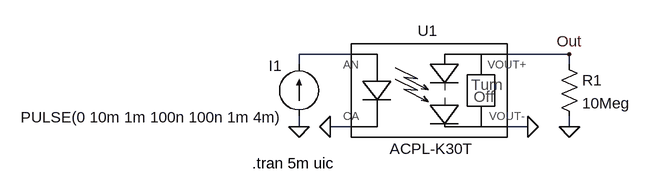
[diagram p0: schematic ACPL-K30T_TRAN.asc]
ACPL-K30T_TRAN.asc, the LTspice schematic file:
Version 4
SHEET 1 896 680
WIRE 160 32 80 32
WIRE 496 32 400 32
WIRE 80 48 80 32
WIRE 496 48 496 32
WIRE 80 144 80 128
WIRE 160 144 128 144
WIRE 432 144 400 144
WIRE 496 144 496 128
FLAG 128 144 0
FLAG 80 144 0
FLAG 432 144 0
FLAG 496 144 0
FLAG 496 32 Out
SYMBOL current 80 128 R180
WINDOW 0 26 78 Left 2
WINDOW 3 23 -1 Left 2
WINDOW 39 0 0 Left 0
SYMATTR InstName I1
SYMATTR Value PULSE(0 10m 1m 100n 100n 1m 4m)
SYMATTR Value2 AC 1 0
SYMBOL res 480 32 R0
SYMATTR InstName R1
SYMATTR Value 10Meg
SYMBOL ACPL-K30T 256 96 R0
SYMATTR InstName U1
TEXT 8 200 Left 2 !.tran 5m uic

The netlist it stands for:
* ACPL-K30T_TRAN.asc
I1 0 N001 PULSE(0 10m 1m 100n 100n 1m 4m) AC 1 0
R1 Out 0 10Meg
XU1 N001 0 Out 0 ACPL-K30T ACPL-K30T  ; pins AN CA VOUT+ VOUT-
.tran 5m uic
.lib ACPL-K30T.cir
.backanno
.end